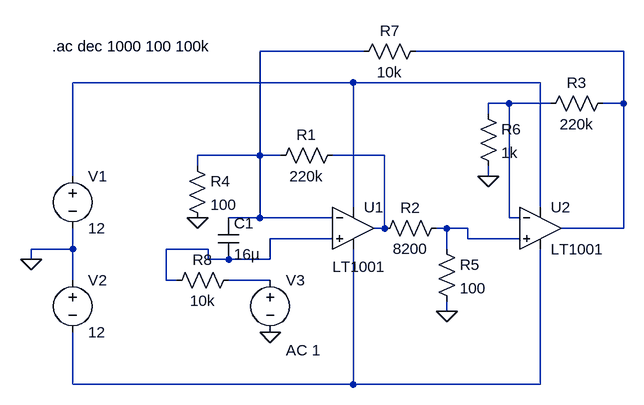
[diagram p0: schematic lab1_1.asc]
lab1_1.asc, the LTspice schematic file:
Version 4
SHEET 1 880 680
WIRE 176 -112 16 -112
WIRE 576 -112 256 -112
WIRE 160 -64 -272 -64
WIRE 448 -64 160 -64
WIRE 400 -32 368 -32
WIRE 464 -32 400 -32
WIRE 576 -32 576 -112
WIRE 576 -32 544 -32
WIRE 368 -16 368 -32
WIRE 16 48 16 -112
WIRE 16 48 -80 48
WIRE 48 48 16 48
WIRE 208 48 128 48
WIRE -80 64 -80 48
WIRE -272 80 -272 -64
WIRE 368 80 368 64
WIRE 160 128 160 -64
WIRE 448 128 448 -64
WIRE 16 144 16 48
WIRE 16 144 -32 144
WIRE 128 144 16 144
WIRE 400 144 400 -32
WIRE 416 144 400 144
WIRE 208 160 208 48
WIRE 208 160 192 160
WIRE 304 160 288 160
WIRE 336 160 304 160
WIRE 576 160 576 -32
WIRE 576 160 480 160
WIRE 128 176 32 176
WIRE 336 176 336 160
WIRE 416 176 336 176
WIRE -272 192 -272 160
WIRE -272 192 -336 192
WIRE -64 192 -128 192
WIRE 304 192 304 160
WIRE -336 208 -336 192
WIRE -64 208 -64 192
WIRE -32 208 -64 208
WIRE 32 208 32 176
WIRE 32 208 -32 208
WIRE -272 240 -272 192
WIRE -128 240 -128 192
WIRE -112 240 -128 240
WIRE 32 240 -32 240
WIRE 304 288 304 272
WIRE -272 400 -272 320
WIRE 160 400 160 192
WIRE 160 400 -272 400
WIRE 448 400 448 192
WIRE 448 400 160 400
FLAG -336 208 0
FLAG -80 144 0
FLAG 304 288 0
FLAG 368 80 0
FLAG 32 320 0
SYMBOL Opamps\\LT1001 160 96 R0
WINDOW 3 -32 123 Left 2
SYMATTR InstName U1
SYMBOL Opamps\\LT1001 448 96 R0
SYMATTR InstName U2
SYMBOL voltage -272 64 R0
WINDOW 123 0 0 Left 2
WINDOW 39 0 0 Left 2
SYMATTR InstName V1
SYMATTR Value 12
SYMBOL voltage -272 224 R0
WINDOW 123 0 0 Left 2
WINDOW 39 0 0 Left 2
SYMATTR InstName V2
SYMATTR Value 12
SYMBOL res 144 32 R90
WINDOW 0 0 56 VBottom 2
WINDOW 3 32 56 VTop 2
SYMATTR InstName R1
SYMATTR Value 220k
SYMBOL res 304 144 R90
WINDOW 0 0 56 VBottom 2
WINDOW 3 32 56 VTop 2
SYMATTR InstName R2
SYMATTR Value 8200
SYMBOL res 560 -48 R90
WINDOW 0 0 56 VBottom 2
WINDOW 3 32 56 VTop 2
SYMATTR InstName R3
SYMATTR Value 220k
SYMBOL res -96 48 R0
SYMATTR InstName R4
SYMATTR Value 100
SYMBOL res 288 176 R0
SYMATTR InstName R5
SYMATTR Value 100
SYMBOL res 352 -32 R0
SYMATTR InstName R6
SYMATTR Value 1k
SYMBOL res 272 -128 R90
WINDOW 0 0 56 VBottom 2
WINDOW 3 32 56 VTop 2
SYMATTR InstName R7
SYMATTR Value 10k
SYMBOL voltage 32 224 R0
WINDOW 123 24 124 Left 2
WINDOW 39 0 0 Left 2
SYMATTR InstName V3
SYMATTR Value ""
SYMATTR Value2 AC 1
SYMBOL cap -48 144 R0
SYMATTR InstName C1
SYMATTR Value 16µ
SYMBOL res -16 224 R90
WINDOW 0 0 56 VBottom 2
WINDOW 3 32 56 VTop 2
SYMATTR InstName R8
SYMATTR Value 10k
TEXT -304 -120 Left 2 !.ac dec 1000 100 100k

The netlist it stands for:
* lab1_1.asc
XU1 N007 N001 N003 N009 N005 LT1001  ; pins In+ In- V+ V- OUT
XU2 N006 N004 N003 N009 N002 LT1001  ; pins In+ In- V+ V- OUT
V1 N003 0 12
V2 0 N009 12
R1 N005 N001 220k
R2 N006 N005 8200
R3 N002 N004 220k
R4 N001 0 100
R5 N006 0 100
R6 N004 0 1k
R7 N002 N001 10k
V3 N008 0 AC 1
C1 N001 N007 16µ
R8 N008 N007 10k
.ac dec 1000 100 100k
.lib LTC.lib
.backanno
.end